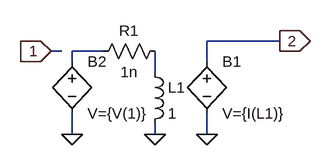
[diagram p0: schematic Integral.asc]
Integral.asc, the LTspice schematic file:
Version 4
SHEET 1 880 680
WIRE 272 112 160 112
WIRE -64 128 -80 128
WIRE 0 128 -48 128
WIRE -48 144 -48 128
WIRE 160 144 160 112
WIRE 80 160 80 128
WIRE -48 256 -48 224
WIRE 80 256 80 240
WIRE 160 256 160 224
FLAG 160 256 0
FLAG 272 112 2
IOPIN 272 112 Out
FLAG -80 128 1
IOPIN -80 128 In
FLAG 80 256 0
FLAG -48 256 0
SYMBOL bv 160 128 R0
SYMATTR InstName B1
SYMATTR Value V={I(L1)}
SYMBOL res 96 112 R90
WINDOW 0 0 56 VBottom 2
WINDOW 3 32 56 VTop 2
SYMATTR InstName R1
SYMATTR Value 1n
SYMBOL ind 64 144 R0
SYMATTR InstName L1
SYMATTR Value 1
SYMBOL bv -48 128 R0
SYMATTR InstName B2
SYMATTR Value V={V(1)}

The netlist it stands for:
* Integral.asc
B1 2 0 V={I(L1)}
R1 N002 N001 1n
L1 N002 0 1
B2 N001 0 V={V(1)}
.backanno
.end